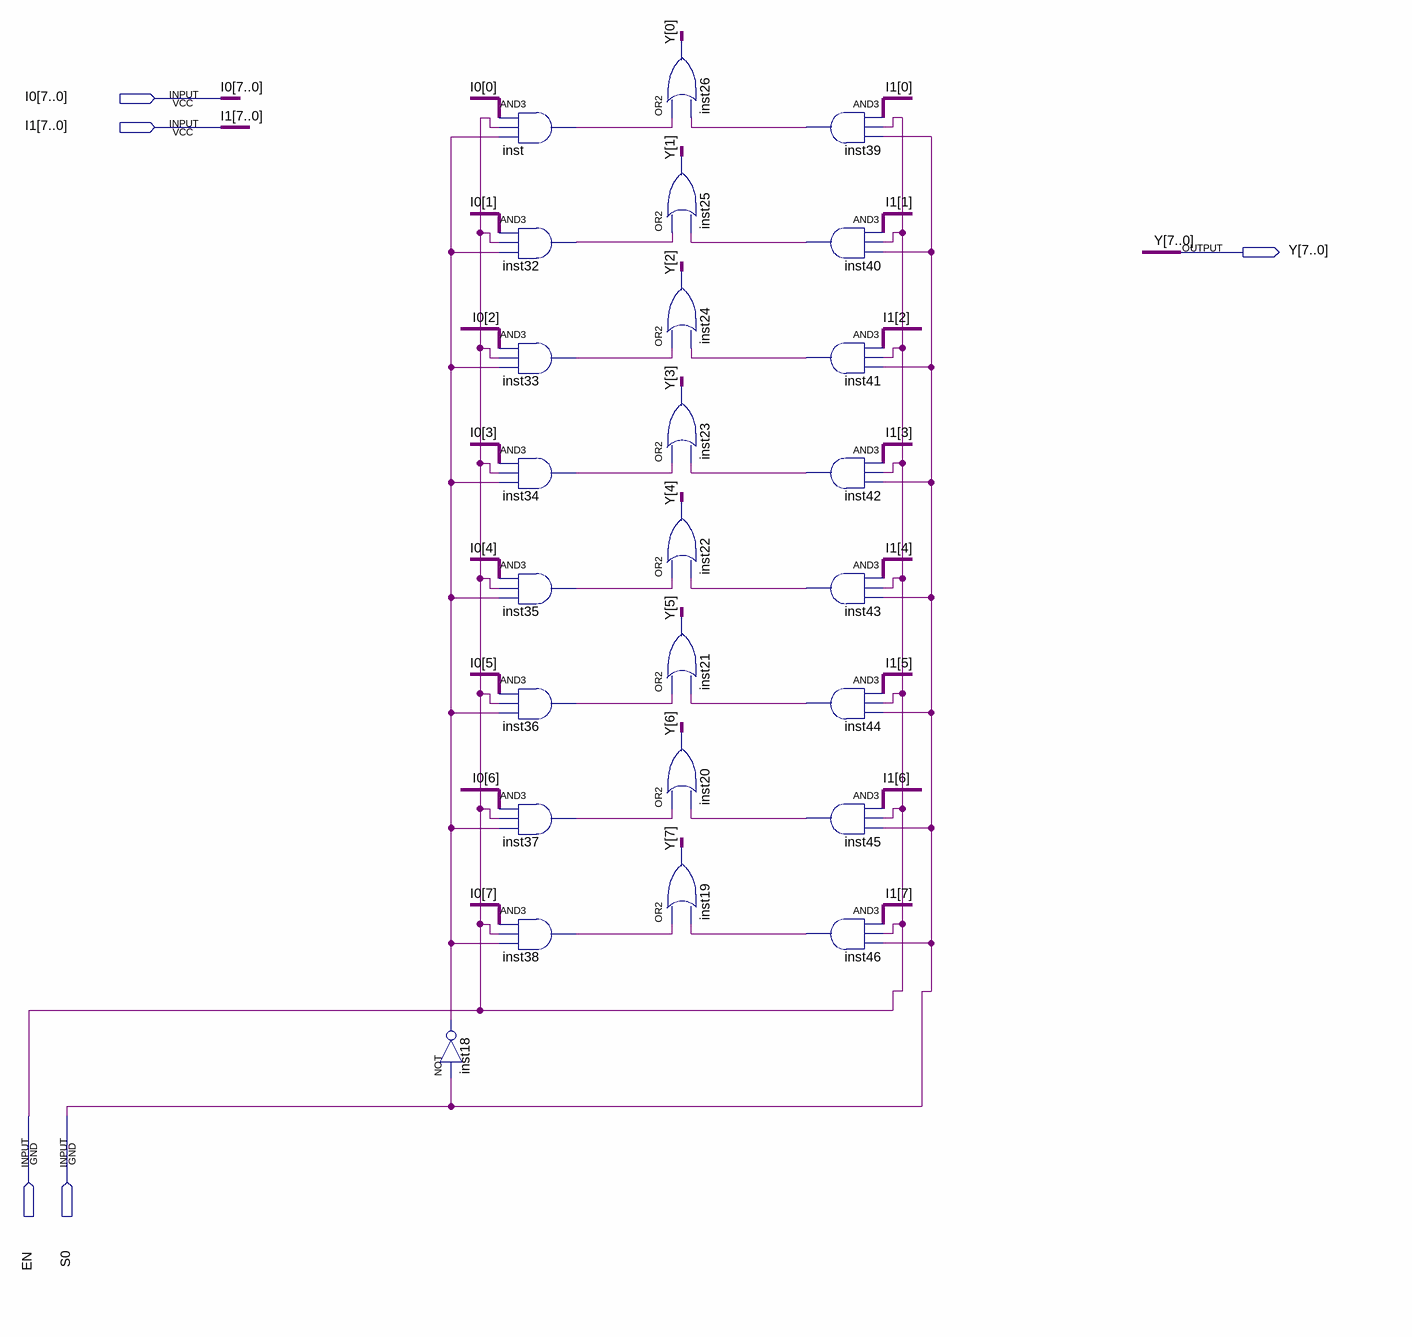
[diagram p0: schematic sheet]
// Quartus schematic mx2x8.bdf as structural Verilog: 25 symbols, 5 pins
module mx2x8 (
  input  [7:0] I0,
  input  [7:0] I1,
  input  EN,
  input  S0,
  output [7:0] Y
);

  wire inst18_out, inst32_out, inst33_out, inst34_out, inst35_out, inst36_out, inst37_out, inst38_out,
       inst39_out, inst40_out, inst41_out, inst42_out, inst43_out, inst44_out, inst45_out, inst46_out,
       inst_out;

  not inst18 (inst18_out, S0);
  and inst (inst_out, I0[0], EN, inst18_out);
  and inst32 (inst32_out, I0[1], EN, inst18_out);
  and inst33 (inst33_out, I0[2], EN, inst18_out);
  and inst34 (inst34_out, I0[3], EN, inst18_out);
  and inst35 (inst35_out, I0[4], EN, inst18_out);
  and inst36 (inst36_out, I0[5], EN, inst18_out);
  and inst37 (inst37_out, I0[6], EN, inst18_out);
  and inst38 (inst38_out, I0[7], EN, inst18_out);
  or inst26 (Y[0], inst_out, inst39_out);
  or inst25 (Y[1], inst32_out, inst40_out);
  or inst24 (Y[2], inst33_out, inst41_out);
  or inst23 (Y[3], inst34_out, inst42_out);
  or inst22 (Y[4], inst35_out, inst43_out);
  or inst21 (Y[5], inst36_out, inst44_out);
  or inst20 (Y[6], inst37_out, inst45_out);
  or inst19 (Y[7], inst38_out, inst46_out);
  and inst39 (inst39_out, I1[0], EN, S0);
  and inst40 (inst40_out, I1[1], EN, S0);
  and inst41 (inst41_out, I1[2], EN, S0);
  and inst42 (inst42_out, I1[3], EN, S0);
  and inst43 (inst43_out, I1[4], EN, S0);
  and inst44 (inst44_out, I1[5], EN, S0);
  and inst45 (inst45_out, I1[6], EN, S0);
  and inst46 (inst46_out, I1[7], EN, S0);
endmodule
